# Altium schematic sheet Channel.SchDoc: Channel: antirrebote de pulsador (hoja hija reutilizable)
size A4; Author: Efrain Alvarado; CompanyName: Universidad de Cuenca - MCIE; DrawnBy: Efrain Alvarado; DocumentNumber: E06-C; Revision: 1.0; SheetNumber: 1; SheetTotal: 1
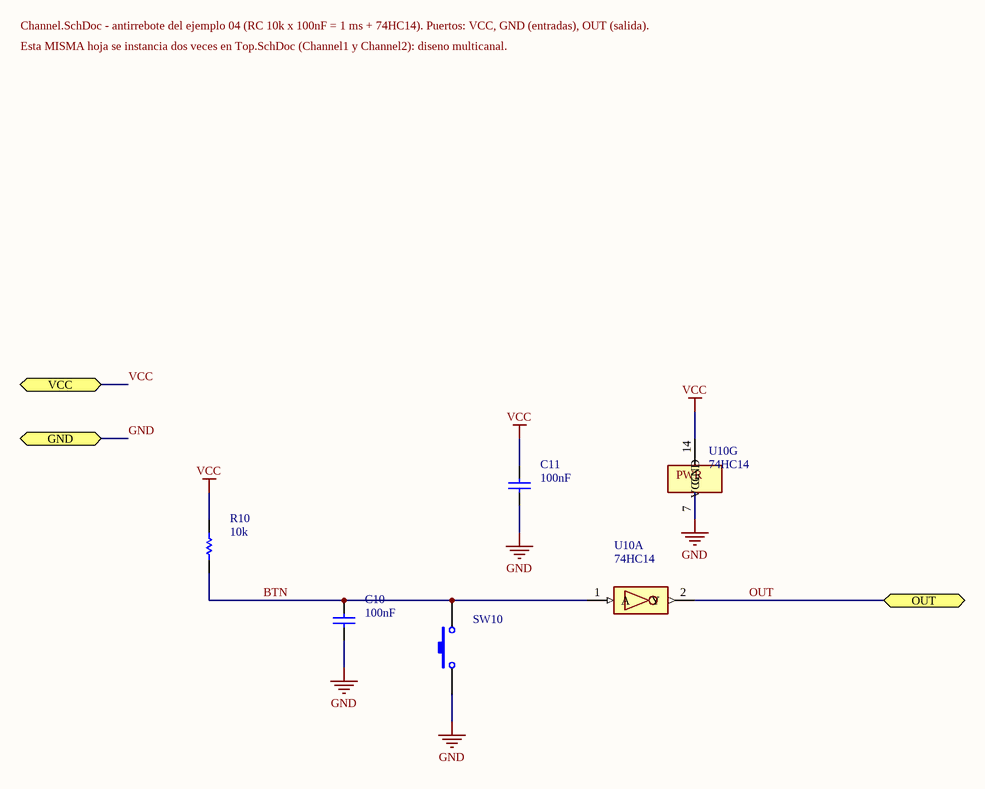
[diagram p0: Channel.SchDoc]

## Parts
C10  value 100nF  [RAD-0.3]  (hidden comment: Cap)
C11  value 100nF  [RAD-0.3]  (hidden comment: Cap)
R10  value 10k  [AXIAL-0.3]  (hidden comment: Res1)
SW10  SW-PB  [SPST-2]  (value not drawn)
U10  74HC14  [DIP-14]  (parts A,G of 7)

## Ports
GND, OUT, VCC

## Nets
GND: C10.1 C11.1 SW10.1 U10.7(GND) ; port GND
VCC: C11.2 R10.2 U10.14(VCC) ; port VCC
BTN: C10.2 R10.1 SW10.2 U10.1(A)
OUT: U10.2(Y) ; port OUT

## Notes on the sheet
- Channel.SchDoc - antirrebote del ejemplo 04 (RC 10k x 100nF = 1 ms + 74HC14). Puertos: VCC, GND (entradas), OUT (salida).
- Esta MISMA hoja se instancia dos veces en Top.SchDoc (Channel1 y Channel2): diseno multicanal.
- (in symbol 74HC14, part G) PWR

## Library data of the parts
C10 = Cap: Capacitor 100 nF (debounce); Manufacturer: KEMET; Manufacturer Part Number: C320C104K5R5TA; Published: 8-Jun-2000; LatestRevisionDate: 17-Jul-2002; LatestRevisionNote: Re-released for DXP Platform.; PackageReference: RAD-0.3; Publisher: Altium Limited; PackageDescription: Radial Cap, Thru-Hole; 2 Leads; 0.3 in Pin Spacing
C11 = Cap: Capacitor 100 nF (desacople U10); Manufacturer: KEMET; Manufacturer Part Number: C320C104K5R5TA; Published: 8-Jun-2000; LatestRevisionDate: 17-Jul-2002; LatestRevisionNote: Re-released for DXP Platform.; PackageReference: RAD-0.3; Publisher: Altium Limited; PackageDescription: Radial Cap, Thru-Hole; 2 Leads; 0.3 in Pin Spacing
R10 = Res1: Resistor 10 kohm (pull-up); Manufacturer: Yageo; Manufacturer Part Number: CFR-25JB-52-10K; Published: 8-Jun-2000; LatestRevisionDate: 17-Jul-2002; LatestRevisionNote: Re-released for DXP Platform.; PackageReference: AXIAL-0.3; Publisher: Altium Limited; PackageDescription: Axial Device, Thru-Hole; 2 Leads; 0.3 in Pin Spacing
SW10 = SW-PB: Pulsador normalmente abierto; Manufacturer: Generic; Manufacturer Part Number: Tactile 6x6; Published: 24-Mar-1999; LatestRevisionDate: 17-Jul-2002; LatestRevisionNote: Re-released for DXP Platform.; PackageReference: SPST-2; Publisher: Altium Limited; PackageDescription: Switch; 2 Leads
U10 = 74HC14: Hex Schmitt-trigger inverter, 6 gates (A-F) + power part G (VCC=14, GND=7); Manufacturer: Texas Instruments; Manufacturer Part Number: SN74HC14N